# EAGLE schematic schematic_eagle_basic (EAGLE 9.6.2)
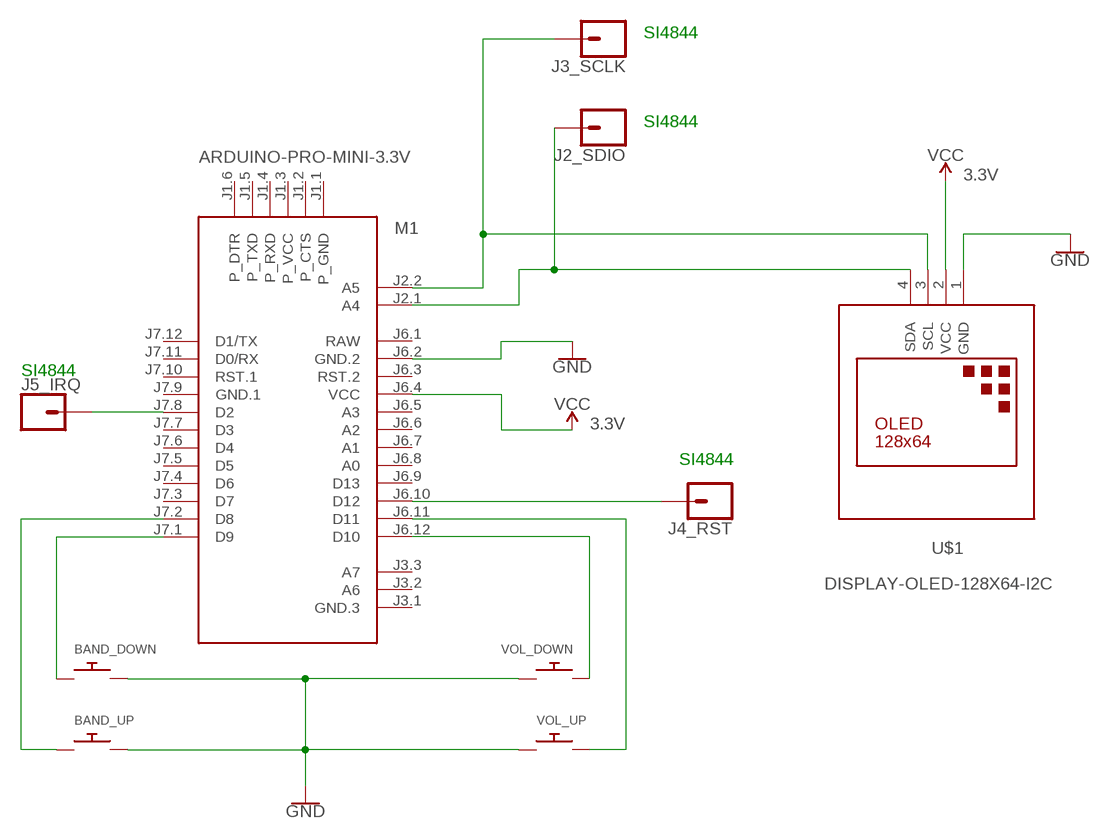
[diagram p0: schematic, sheet 1]

## Parts
BAND_DOWN  SWITCH_PUSHBUTTONC&K_KSS  [BTN_CK_KSS]
BAND_UP  SWITCH_PUSHBUTTONC&K_KSS  [BTN_CK_KSS]
J2_SDIO  CONN_01  [1X01]
J3_SCLK  CONN_01  [1X01]
J4_RST  CONN_01  [1X01]
J5_IRQ  CONN_01  [1X01]
M1  ARDUINO-PRO-MINI-3.3V  [ARDUINO-PRO-MINI]
U$1  DISPLAY-OLED-128X64-I2C  [DISPLAY-OLED-128X64-I2C]
VOL_DOWN  SWITCH_PUSHBUTTONC&K_KSS  [BTN_CK_KSS]
VOL_UP  SWITCH_PUSHBUTTONC&K_KSS  [BTN_CK_KSS]

## Nets
GND: BAND_DOWN.P$2 BAND_UP.P$2 M1.J6.2(GND.2) U$1.1(GND) VOL_DOWN.P$1 VOL_UP.P$1
N$1: J3_SCLK.1 M1.J2.2(A5) U$1.3(SCL)
N$2: J4_RST.1 M1.J6.10(D12)
N$3: J2_SDIO.1 M1.J2.1(A4) U$1.4(SDA)
N$4: J5_IRQ.1 M1.J7.8(D2)
N$5: M1.J6.11(D11) VOL_UP.P$2
N$7: BAND_DOWN.P$1 M1.J7.1(D9)
N$8: BAND_UP.P$1 M1.J7.2(D8)
N$9: M1.J6.12(D10) VOL_DOWN.P$2
VCC: M1.J6.4(VCC) U$1.2(VCC)
Unconnected: M1.J1.1(P_GND) M1.J1.2(P_CTS) M1.J1.3(P_VCC) M1.J1.4(P_RXD) M1.J1.5(P_TXD) M1.J1.6(P_DTR) M1.J3.1(GND.3) M1.J3.2(A6) M1.J3.3(A7) M1.J6.3(RST.2) M1.J6.5(A3) M1.J6.6(A2) M1.J6.7(A1) M1.J6.8(A0) M1.J6.9(D13) M1.J7.3(D7) M1.J7.4(D6) M1.J7.5(D5) M1.J7.6(D4) M1.J7.7(D3) M1.J7.10(RST.1) M1.J7.11(D0/RX) M1.J7.12(D1/TX)

## Notes on the sheet
- SI4844
- SI4844
- SI4844
- SI4844

## Power pins joined to a net without a drawn wire
GND.1: M1.J7.9(GND.1)
RAW: M1.J6.1(RAW)

## Library data of the parts
BAND_DOWN BAND_UP VOL_DOWN VOL_UP = adafruit:SWITCH_PUSHBUTTON: Buttons SOFTTOUCHSMD_SJ - Soft touch temporary push button (Super Junk Akihabara) Compatible with SKPMANE010 [Mouser: 688-SKPMAN] C&K_KSS = Digikey: KSS221GLFS
J2_SDIO J3_SCLK J4_RST J5_IRQ = SparkFun-Connectors:CONN_01: Single connection point. Often used as Generic Header-pin footprint for 0.1 inch spaced/style header connections On any of the 0.1 inch spaced packages, you can populate with these: Break Away Headers - Straight <https://www.sparkfun.com/products/116> (PRT-00116) Break Away Male Headers - Right Angle <https://www.sparkfun.com/products/553> (PRT-00553) Female Headers <https://www.sparkfun.com/products/115> (PRT-00115) Break Away Headers - Machine Pin <https://www.sparkfun.com/products/117> (PRT-00117) Break Away Female Headers - Swiss Machine Pin <https://www.sparkfun.com/products/743> (PRT-00743) This device is also useful as a general connection point to wire up your design to another part of your project. Our various solder wires solder well into these plated through hole pads. Hook-Up Wire - Assortment (Stranded, 22 AWG) <https://www.sparkfun.com/products/11375> (PRT-11375) Hook-Up Wire - Assortment (Solid Core, 22 AWG) <https://www.sparkfun.com/products/11367> (PRT-11367) View the entire wire category on our website here <https://www.sparkfun.com/categories/141> Special notes: SMTSO-256-ET is a "flush mount" nut for a 4-40 screw. We mostly use this on specialty testbeds; it is a nice way to connect hardware to your PCB at an adjustable hieght. Also note, the SNAP packages are for using a snappable style connector. We sell a baggie of snaps and they are also used on two LilyPad designs: Snap Assortment - 30 pack (male and female) <https://www.sparkfun.com/products/11347> (DEV-11347) LilyPad Arduino SimpleSnap <https://www.sparkfun.com/products/10941> (DEV-10941) LilyPad SimpleSnap Protoboard <https://www.sparkfun.com/products/10940> (DEV-10940)
M1 = diy-modules:ARDUINO-PRO-MINI-*: Arduino Pro Mini and compatible devices More details available here: https://www.arduino.cc/en/Main/ArduinoBoardProMini Click here to find device on ebay.com <http://www.ebay.com/sch/arduino+pro+mini>
U$1 = diy-modules:DISPLAY-OLED-128X64-I2C: 128x64 Dot Matrix OLED Module based on SSD1306 chip Variant with I2C interface More details available here: http://www.instructables.com/id/Monochrome-096-i2c-OLED-display-with-arduino-SSD13/ SSD1306 datasheet: https://cdn-shop.adafruit.com/datasheets/SSD1306.pdf Click here to find device on ebay.com <http://www.ebay.com/sch/oled+display+128x64+iic> Note: There are two variants: I2C and SPI. Search for the proper version.

## Module TESTE
Ports: 

### Library data of the parts